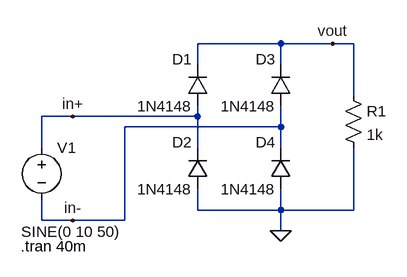
[diagram p0: schematic diode_PD2.asc]
diode_PD2.asc, the LTspice schematic file:
Version 4
SHEET 1 880 680
WIRE -272 16 -400 16
WIRE -192 16 -272 16
WIRE -160 16 -192 16
WIRE -400 48 -400 16
WIRE -272 48 -272 16
WIRE -160 96 -160 16
WIRE -592 128 -640 128
WIRE -400 128 -400 112
WIRE -400 128 -592 128
WIRE -272 144 -272 112
WIRE -272 144 -512 144
WIRE -640 176 -640 128
WIRE -400 176 -400 128
WIRE -272 176 -272 144
WIRE -400 272 -400 240
WIRE -272 272 -272 240
WIRE -272 272 -400 272
WIRE -160 272 -160 176
WIRE -160 272 -272 272
WIRE -640 288 -640 256
WIRE -592 288 -640 288
WIRE -512 288 -512 144
WIRE -512 288 -592 288
WIRE -272 304 -272 272
FLAG -592 128 in+
FLAG -592 288 in-
FLAG -192 16 vout
FLAG -272 304 0
SYMBOL voltage -640 160 R0
WINDOW 123 0 0 Left 0
WINDOW 39 0 0 Left 0
WINDOW 3 -31 145 Left 0
SYMATTR Value SINE(0 10 50)
SYMATTR InstName V1
SYMBOL diode -384 112 R180
WINDOW 0 24 72 Left 0
WINDOW 3 24 0 Left 0
SYMATTR InstName D1
SYMATTR Value 1N4148
SYMBOL diode -384 240 R180
WINDOW 0 24 72 Left 0
WINDOW 3 24 0 Left 0
SYMATTR InstName D2
SYMATTR Value 1N4148
SYMBOL diode -256 112 R180
WINDOW 0 24 72 Left 0
WINDOW 3 24 0 Left 0
SYMATTR InstName D3
SYMATTR Value 1N4148
SYMBOL diode -256 240 R180
WINDOW 0 24 72 Left 0
WINDOW 3 24 0 Left 0
SYMATTR InstName D4
SYMATTR Value 1N4148
SYMBOL res -176 80 R0
SYMATTR InstName R1
SYMATTR Value 1k
TEXT -672 328 Left 0 !.tran 40m

The netlist it stands for:
* diode_PD2.asc
V1 in+ in- SINE(0 10 50)
D1 in+ vout 1N4148
D2 0 in+ 1N4148
D3 in- vout 1N4148
D4 0 in- 1N4148
R1 vout 0 1k
.model D D
.lib standard.dio
.tran 40m
.backanno
.end